# EAGLE design KeepUntil-v1.0.4 (EAGLE 7.5.0)
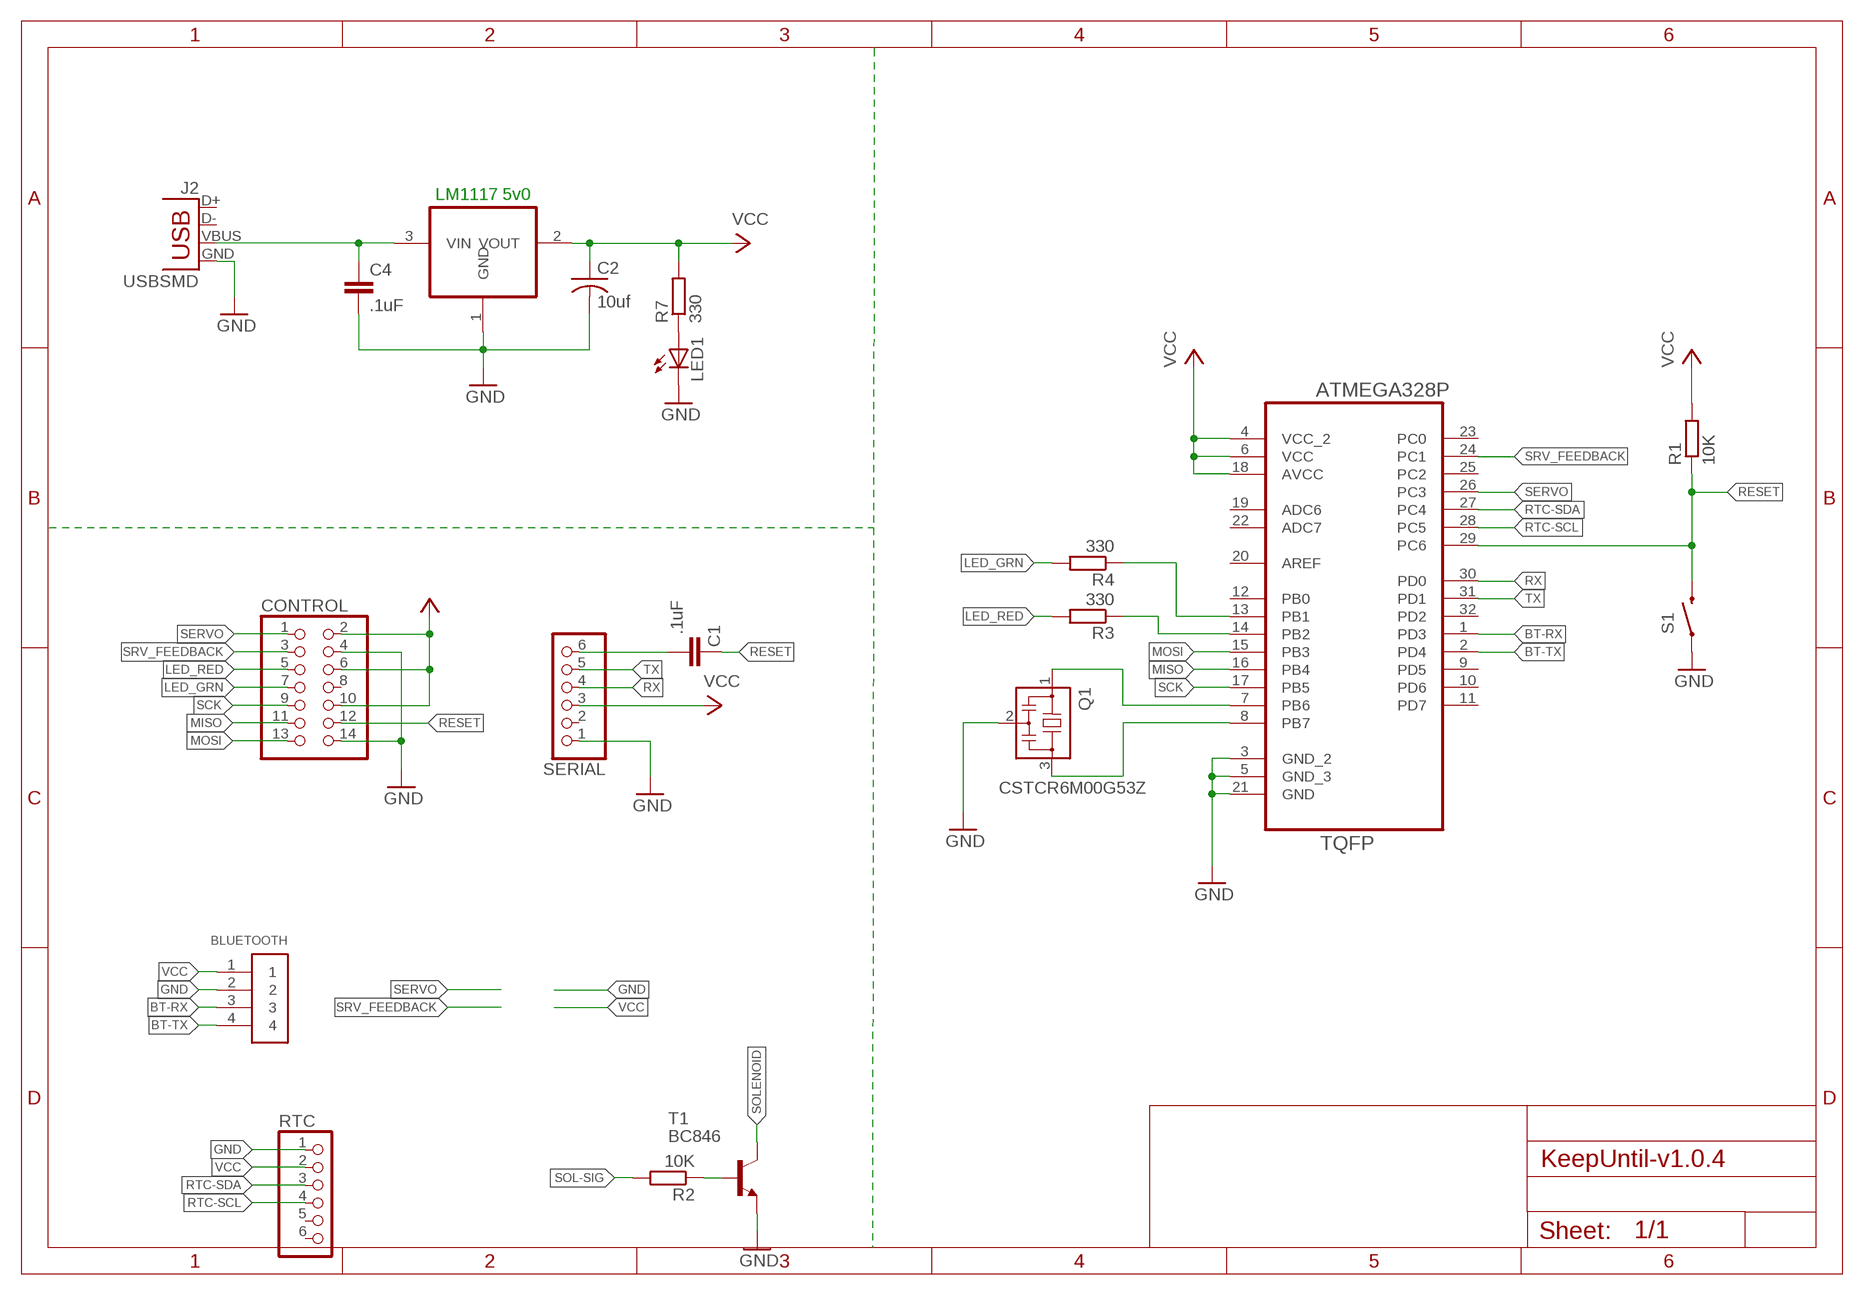
[diagram p0: schematic, sheet 1]

## Parts
BLUETOOTH  1X4-CLEANBIG  [1X04-CLEANBIG]
C1  .1uF  C-EUC0805  [C0805]
C2  10uf  C-USC1206  [C1206]
C4  .1uF  C-EUC0805  [C0805]
CONTROL  PINHD-2X7  [2X07]
IC2  REG1117  [SOT223]
J2  USBSMD  [USB-MINIB]
LED1  LEDSMT1206  [1206]
Q1  CSTCR6M00G53Z  [CSTCR6M]
R1  10K  R-EU_R0805  [R0805]
R2  10K  R-EU_R0805  [R0805]
R3  330  R-EU_R0805  [R0805]
R4  330  R-EU_R0805  [R0805]
R7  330  R-EU_R0805  [R0805]
RTC  PINHD-1X6CLEAN  [1X06-CLEAN]
S1  SWITCH-MOMENTARY-2SMD-1101NE  [TACTILE-SWITCH-1101NE]
SERIAL  PINHD-1X6CLEAN  [1X06-CLEAN]
T1  BC846  [SOT23]
U1  ATMEGA328P-AU  [QFP80P900X900X120-32N]

## Nets
BT-RX: BLUETOOTH.3 U1.1(PD3)
BT-TX: BLUETOOTH.4 U1.2(PD4)
GND: BLUETOOTH.2 C2.2 C4.2 CONTROL.4 CONTROL.14 IC2.1(GND) J2.GND LED1.C Q1.2 RTC.1 S1.1 SERIAL.1 T1.2(E) U1.3(GND_2) U1.5(GND_3) U1.21(GND)
LED_GRN: CONTROL.7 R4.2
LED_RED: CONTROL.5 R3.2
MISO: CONTROL.11 U1.16(PB4)
MOSI: CONTROL.13 U1.15(PB3)
N$1: Q1.1 U1.7(PB6)
N$2: Q1.3 U1.8(PB7)
N$3: R2.1 T1.1(B)
N$4: C4.1 IC2.3(VIN) J2.VBUS
N$7: LED1.A R7.1
N$8: R3.1 U1.14(PB2)
N$9: R4.1 U1.13(PB1)
N$17: C1.2 SERIAL.6
RESET: C1.1 CONTROL.12 R1.1 S1.2 U1.29(PC6)
RTC-SCL: RTC.4 U1.28(PC5)
RTC-SDA: RTC.3 U1.27(PC4)
RX: SERIAL.4 U1.30(PD0)
SCK: CONTROL.9 U1.17(PB5)
SERVO: CONTROL.1 U1.26(PC3)
SOL-SIG: R2.2
SOLENOID: T1.3(C)
SRV_FEEDBACK: CONTROL.3 U1.24(PC1)
TX: SERIAL.5 U1.31(PD1)
VCC: BLUETOOTH.1 C2.1 CONTROL.2 CONTROL.6 CONTROL.10 IC2.2(VOUT) R1.2 R7.2 RTC.2 SERIAL.3 U1.4(VCC_2) U1.6(VCC) U1.18(AVCC)
Unconnected: CONTROL.8 J2.D+ J2.D- RTC.5 RTC.6 SERIAL.2 U1.9(PD5) U1.10(PD6) U1.11(PD7) U1.12(PB0) U1.19(ADC6) U1.20(AREF) U1.22(ADC7) U1.23(PC0) U1.25(PC2) U1.32(PD2)

## Notes on the sheet
- LM1117 5v0

## Library data of the parts
BLUETOOTH = adafruit:1X4: 4-pin connector
C1 C4 = resistor:C-EU: CAPACITOR, European symbol
C2 = resistor:C-US: CAPACITOR, American symbol
CONTROL = pinhead:PINHD-2X7: PIN HEADER
IC2 = burr-brown:REG1117: 800mA and 1A Low Dropout (LDO) Positive Regulator 1.8V, 2.5V, 2.85V, 3.3V, 5V, and Adj; MPN: LM1117 3v3; OC_FARNELL: 1097566; OC_NEWARK: 14P6981
J2 = SparkFun-Connectors:USB: USB Connectors USB-B-PTH is fully proven SKU : PRT-00139/CONN-08278 USB-miniB is fully proven SKU : PRT-00587 USB-A-PCB is untested. USB-A-H is throughly reviewed, but untested. Spark Fun Electronics SKU : PRT-00437 USB-B-SMT is throughly reviewed, but untested. Needs silkscreen touching up. USB-A-S has not been used/tested USB-MB-H has not been used/tested USB-MICROB has been used. CONN-09505; PROD_ID: CONN-08193
LED1 = led:LED: LED OSRAM: - CHIPLED LG R971, LG N971, LY N971, LG Q971, LY Q971, LO R971, LY R971 LH N974, LH R974 LS Q976, LO Q976, LY Q976 LO Q996 - Hyper CHIPLED LW Q18S LB Q993, LB Q99A, LB R99A - SideLED LS A670, LO A670, LY A670, LG A670, LP A670 LB A673, LV A673, LT A673, LW A673 LH A674 LY A675 LS A676, LA A676, LO A676, LY A676, LW A676 LS A679, LY A679, LG A679 - Hyper Micro SIDELED® LS Y876, LA Y876, LO Y876, LY Y876 LT Y87S - SmartLED LW L88C, LW L88S LB L89C, LB L89S, LG L890 LS L89K, LO L89K, LY L89K LS L896, LA L896, LO L896, LY L896 - TOPLED LS T670, LO T670, LY T670, LG T670, LP T670 LSG T670, LSP T670, LSY T670, LOP T670, LYG T670 LG T671, LOG T671, LSG T671 LB T673, LV T673, LT T673, LW T673 LH T674 LS T676, LA T676, LO T676, LY T676, LB T676, LH T676, LSB T676, LW T676 LB T67C, LV T67C, LT T67C, LS T67K, LO T67K, LY T67K, LW E67C LS E67B, LA E67B, LO E67B, LY E67B, LB E67C, LV E67C, LT E67C LW T67C LS T679, LY T679, LG T679 LS T770, LO T770, LY T770, LG T770, LP T770 LB T773, LV T773, LT T773, LW T773 LH T774 LS E675, LA E675, LY E675, LS T675 LS T776, LA T776, LO T776, LY T776, LB T776 LHGB T686 LT T68C, LB T68C - Hyper Mini TOPLED® LB M676 - Mini TOPLED Santana® LG M470 LS M47K, LO M47K, LY M47K Source: http://www.osram.convergy.de LUXEON: - LUMILED® LXK2-PW12-R00, LXK2-PW12-S00, LXK2-PW14-U00, LXK2-PW14-V00 LXK2-PM12-R00, LXK2-PM12-S00, LXK2-PM14-U00 LXK2-PE12-Q00, LXK2-PE12-R00, LXK2-PE12-S00, LXK2-PE14-T00, LXK2-PE14-U00 LXK2-PB12-K00, LXK2-PB12-L00, LXK2-PB12-M00, LXK2-PB14-N00, LXK2-PB14-P00, LXK2-PB14-Q00 LXK2-PR12-L00, LXK2-PR12-M00, LXK2-PR14-Q00, LXK2-PR14-R00 LXK2-PD12-Q00, LXK2-PD12-R00, LXK2-PD12-S00 LXK2-PH12-R00, LXK2-PH12-S00 LXK2-PL12-P00, LXK2-PL12-Q00, LXK2-PL12-R00 Source: www.luxeon.com KINGBRIGHT: KA-3528ASYC Source: www.kingbright.com
Q1 = murata-filter:CSTCR: Resonator Source: murata.co.jp; MPN: CSTCR6M00G53-R0; OC_FARNELL: 1170434; OC_NEWARK: 25M8759
R1-R4 R7 = resistor:R-EU_: RESISTOR, European symbol
RTC SERIAL = adafruit:PINHD-1X6: PIN HEADER
S1 = SparkFun-Electromechanical:SWITCH-MOMENTARY-2: Various NO switches- pushbuttons, reed, etc; PROD_ID: SWCH-00815
T1 = transistor:BC846: NPN TRANSISTOR
U1 = Ava:ATMEGA328P-AU; DESCRIPTION: 8-bit Microcontroller with In-System Programmable Flash; MPN: ATMEGA328P-AU; OC_FARNELL: 1715486; OC_NEWARK: 14R4631; PACKAGE: TQFP-32; SUPPLIER: Atmel

## Board
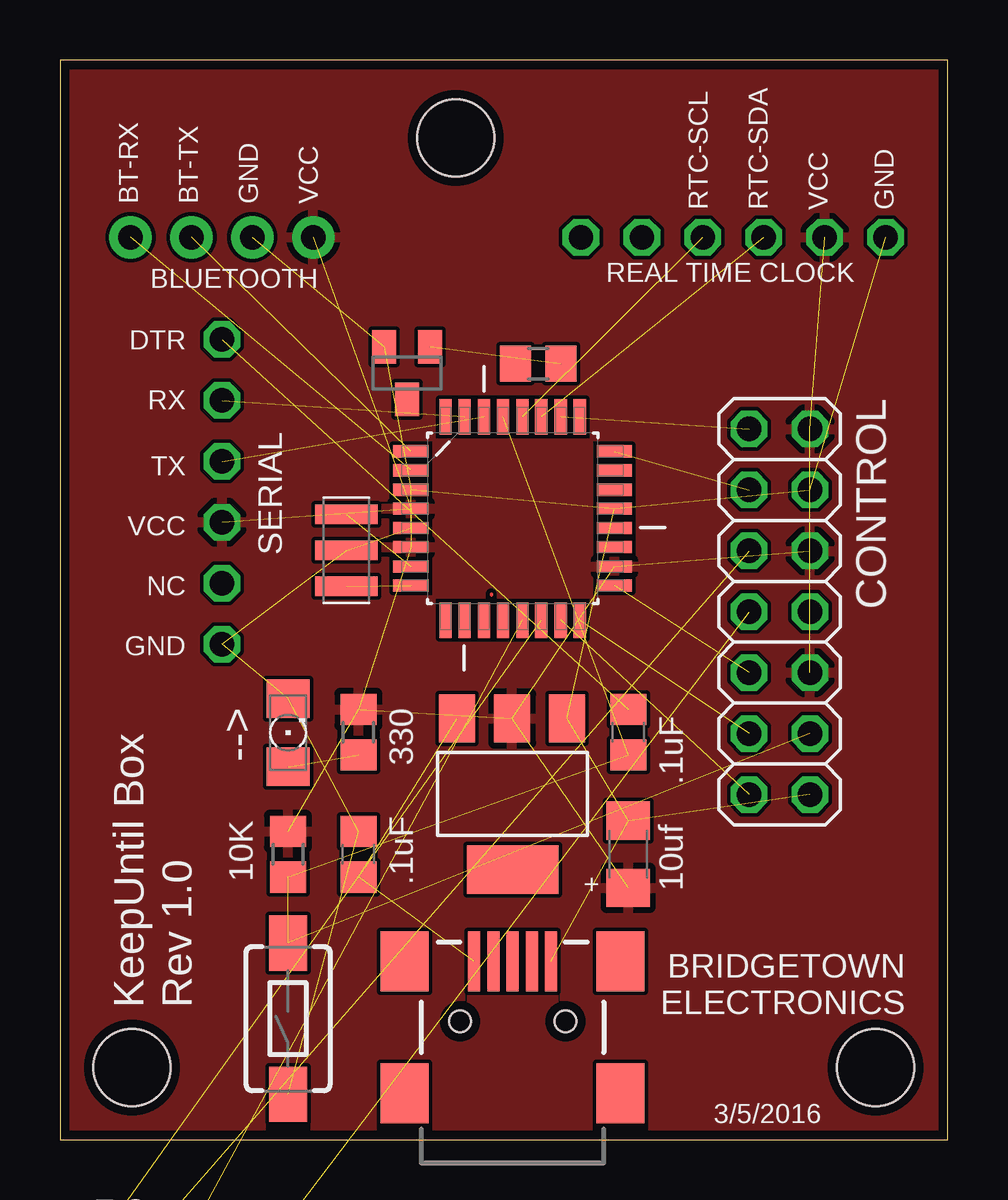
[diagram p1: board, top side]
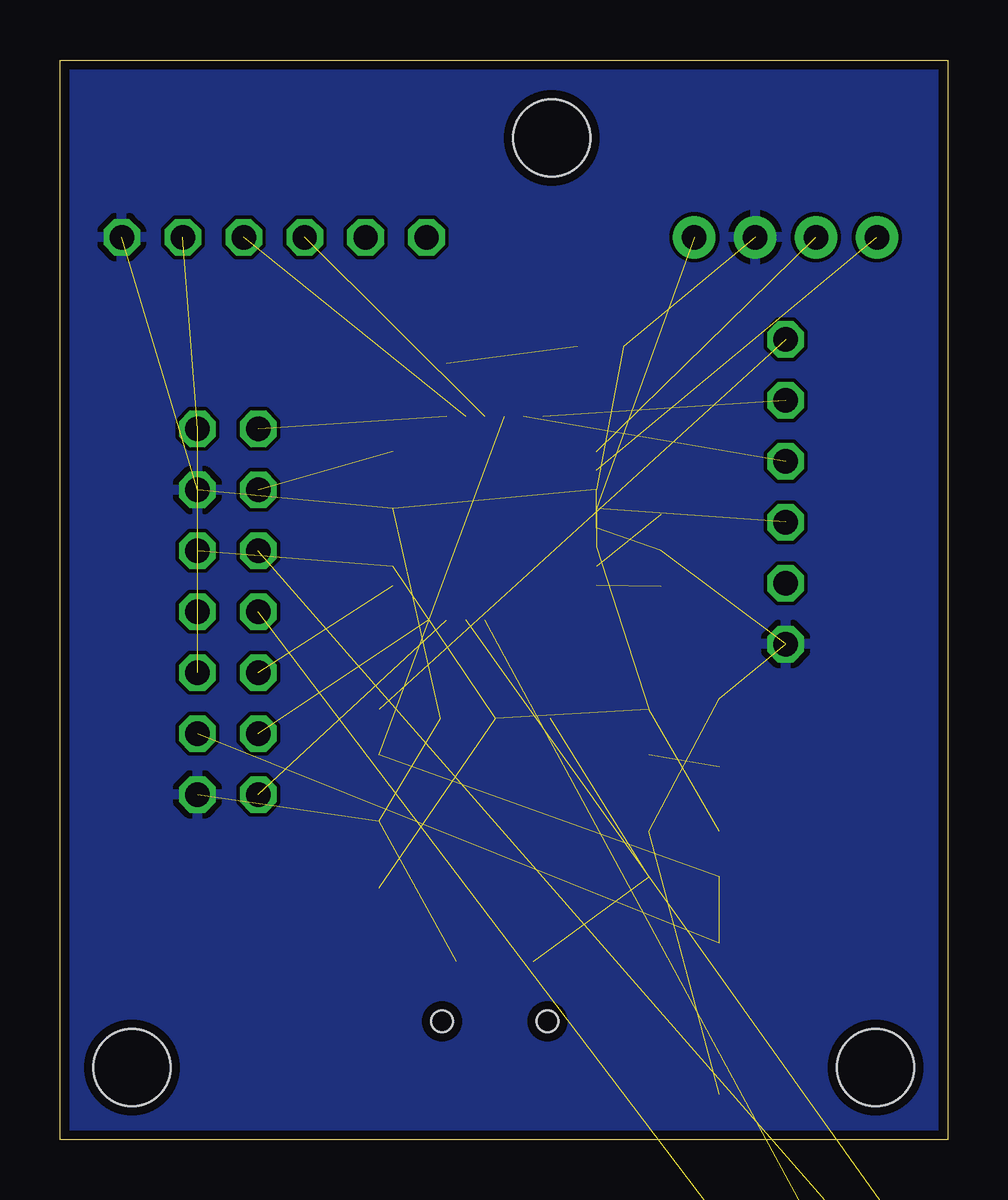
[diagram p2: board, bottom side, seen from below]

Size 37 x 45 mm. Coordinates in mm from the lower left corner, seen from the top.
Outline: 0,0 37,0 37,45 0,45 0,0
Copper layers (1*16): Top 0.0356mm / dielectric 1.5011mm / Bottom 0.0356mm
Design rules "oshpark-2layer": minimum track width 6mil, minimum drill 13mil, track to track 6mil, track to pad 6mil, pad to pad 6mil, via to via 6mil, smd to smd 6mil, copper to edge 15mil, drill to drill 6mil, minimum pad ring 7mil, minimum via ring 7mil, stop-mask expansion 2.5mil, vias tented up to drill 0mil, thermal gap 10mil
Holes 3.2 mm at 3,3 16.5,41.75 34,3

### Footprints (pad centres in the part's own frame; a part is rotated, then mirrored left to right if it is on the bottom)
1X04-CLEANBIG = drill 1.016 pad 1.778: 1 -3.81,0; 2 -1.27,0; 3 1.27,0; 4 3.81,0
C0805 = smd 1.3 x 1.5: 1 -0.95,0; 2 0.95,0
C1206 = smd 1.6 x 1.8: 1 -1.4,0; 2 1.4,0
2X07 = drill 1.016 octagon: 1 -7.62,-1.27; 2 -7.62,1.27; 3 -5.08,-1.27; 4 -5.08,1.27; 5 -2.54,-1.27; 6 -2.54,1.27; 7 0,-1.27; 8 0,1.27; 9 2.54,-1.27; 10 2.54,1.27; 11 5.08,-1.27; 12 5.08,1.27; 13 7.62,-1.27; 14 7.62,1.27
SOT223 = smd 1.499 x 2.007: 1 -2.261,-3.15; 2 0.025,-3.15; 3 2.311,-3.15 | smd 3.81 x 2.007: 4 0,3.15
USB-MINIB = smd 2.5 x 0.5: D+ 2.5,0; D- 2.5,0.8; GND 2.5,-1.6; ID 2.5,-0.8; VBUS 2.5,1.6 | smd 2.5 x 2: MTN1 -3,4.5; MTN2 2.5,4.5; MTN3 -3,-4.5; MTN4 2.5,-4.5 | hole 0.9: 0,2.2; 0,-2.2
1206 = smd 1.6 x 1.803: A -1.422,0; C 1.422,0
CSTCR6M = smd 0.8 x 2.6: 1 -1.5,0; 2 0,0; 3 1.5,0
R0805 = smd 1.3 x 1.5: 1 -0.95,0; 2 0.95,0
1X06-CLEAN = drill 1.016 octagon: 1 -6.35,0; 2 -3.81,0; 3 -1.27,0; 4 1.27,0; 5 3.81,0; 6 6.35,0
TACTILE-SWITCH-1101NE = smd 2.3 x 1.6: 1 -3.15,0; 2 3.15,0
SOT23 = smd 1 x 1.4: 1 -0.95,-1.1; 2 0.95,-1.1; 3 0,1.1
QFP80P900X900X120-32N = smd 1.473 x 0.508: 1 -4.242,2.794; 2 -4.242,2.007; 3 -4.242,1.194; 4 -4.242,0.406; 5 -4.242,-0.406; 6 -4.242,-1.194; 7 -4.242,-2.007; 8 -4.242,-2.794; 17 4.242,-2.794; 18 4.242,-2.007; 19 4.242,-1.194; 20 4.242,-0.406; 21 4.242,0.406; 22 4.242,1.194; 23 4.242,2.007; 24 4.242,2.794 | smd 0.508 x 1.473: 9 -2.794,-4.242; 10 -2.007,-4.242; 11 -1.194,-4.242; 12 -0.406,-4.242; 13 0.406,-4.242; 14 1.194,-4.242; 15 2.007,-4.242; 16 2.794,-4.242; 25 2.794,4.242; 26 2.007,4.242; 27 1.194,4.242; 28 0.406,4.242; 29 -0.406,4.242; 30 -1.194,4.242; 31 -2.007,4.242; 32 -2.794,4.242

### Placement (x,y rotation side)
BLUETOOTH  6.75,37.61 180 top
C1  23.69,16.98 90 top
C2  23.69,11.89 90 top
C4  12.44,11.89 90 top
CONTROL  30,22 270 top
IC2  18.87,14.4 180 top
J2  18.87,4.93 90 top
LED1  9.51,16.96 90 top
Q1  11.94,24.56 270 top
R1  9.51,11.89 90 top
R2  19.94,32.34 180 top
R3  2,-5 0 top  (outside the outline)
R4  2,-12 0 top  (outside the outline)
R7  12.44,16.98 90 top
RTC  28.07,37.61 180 top
S1  9.51,5.04 90 top
SERIAL  6.75,27 90 top
T1  14.47,31.95 180 top
U1  18.87,25.89 0 top

### Tracks (layer width: path | path; a pad name or v marks a point on that pad's centre or on a via)
BT-RX  (1 unrouted)
BT-TX  (1 unrouted)
GND  (15 unrouted)
  pour Bottom: 0,0 37,0 37,45 0,45
LED_GRN  (1 unrouted)
LED_RED  (1 unrouted)
MISO  (1 unrouted)
MOSI  (1 unrouted)
N$1  (1 unrouted)
N$2  (1 unrouted)
N$3  (1 unrouted)
N$4  (2 unrouted)
N$5
  Top 0.152: 17.98,22.71 17.98,22.74
N$7  (1 unrouted)
N$8  (1 unrouted)
N$9  (1 unrouted)
N$17  (1 unrouted)
RESET  (4 unrouted)
RTC-SCL  (1 unrouted)
RTC-SDA  (1 unrouted)
RX  (1 unrouted)
SCK  (1 unrouted)
SERVO  (1 unrouted)
SRV_FEEDBACK  (1 unrouted)
TX  (1 unrouted)
VCC  (12 unrouted)
  pour Top: 0,0 37,0 37,45 0,45

### Text on the board
tPlace: BT-RX | BT-TX | GND | VCC | RTC-SCL | RTC-SDA | VCC | GND | BLUETOOTH | REAL TIME CLOCK | DTR | SRVO/GND | NC/VCC | RX | SERIAL | SOL/VCC | TX | VCC | NC | GND | --> | + | BRIDGETOWN / ELECTRONICS | KeepUntil Box | Rev 1.0 | 3/5/2016